# Altium schematic sheet STM32.SchDoc
size A3; SheetNumber: 2; SheetTotal: 2
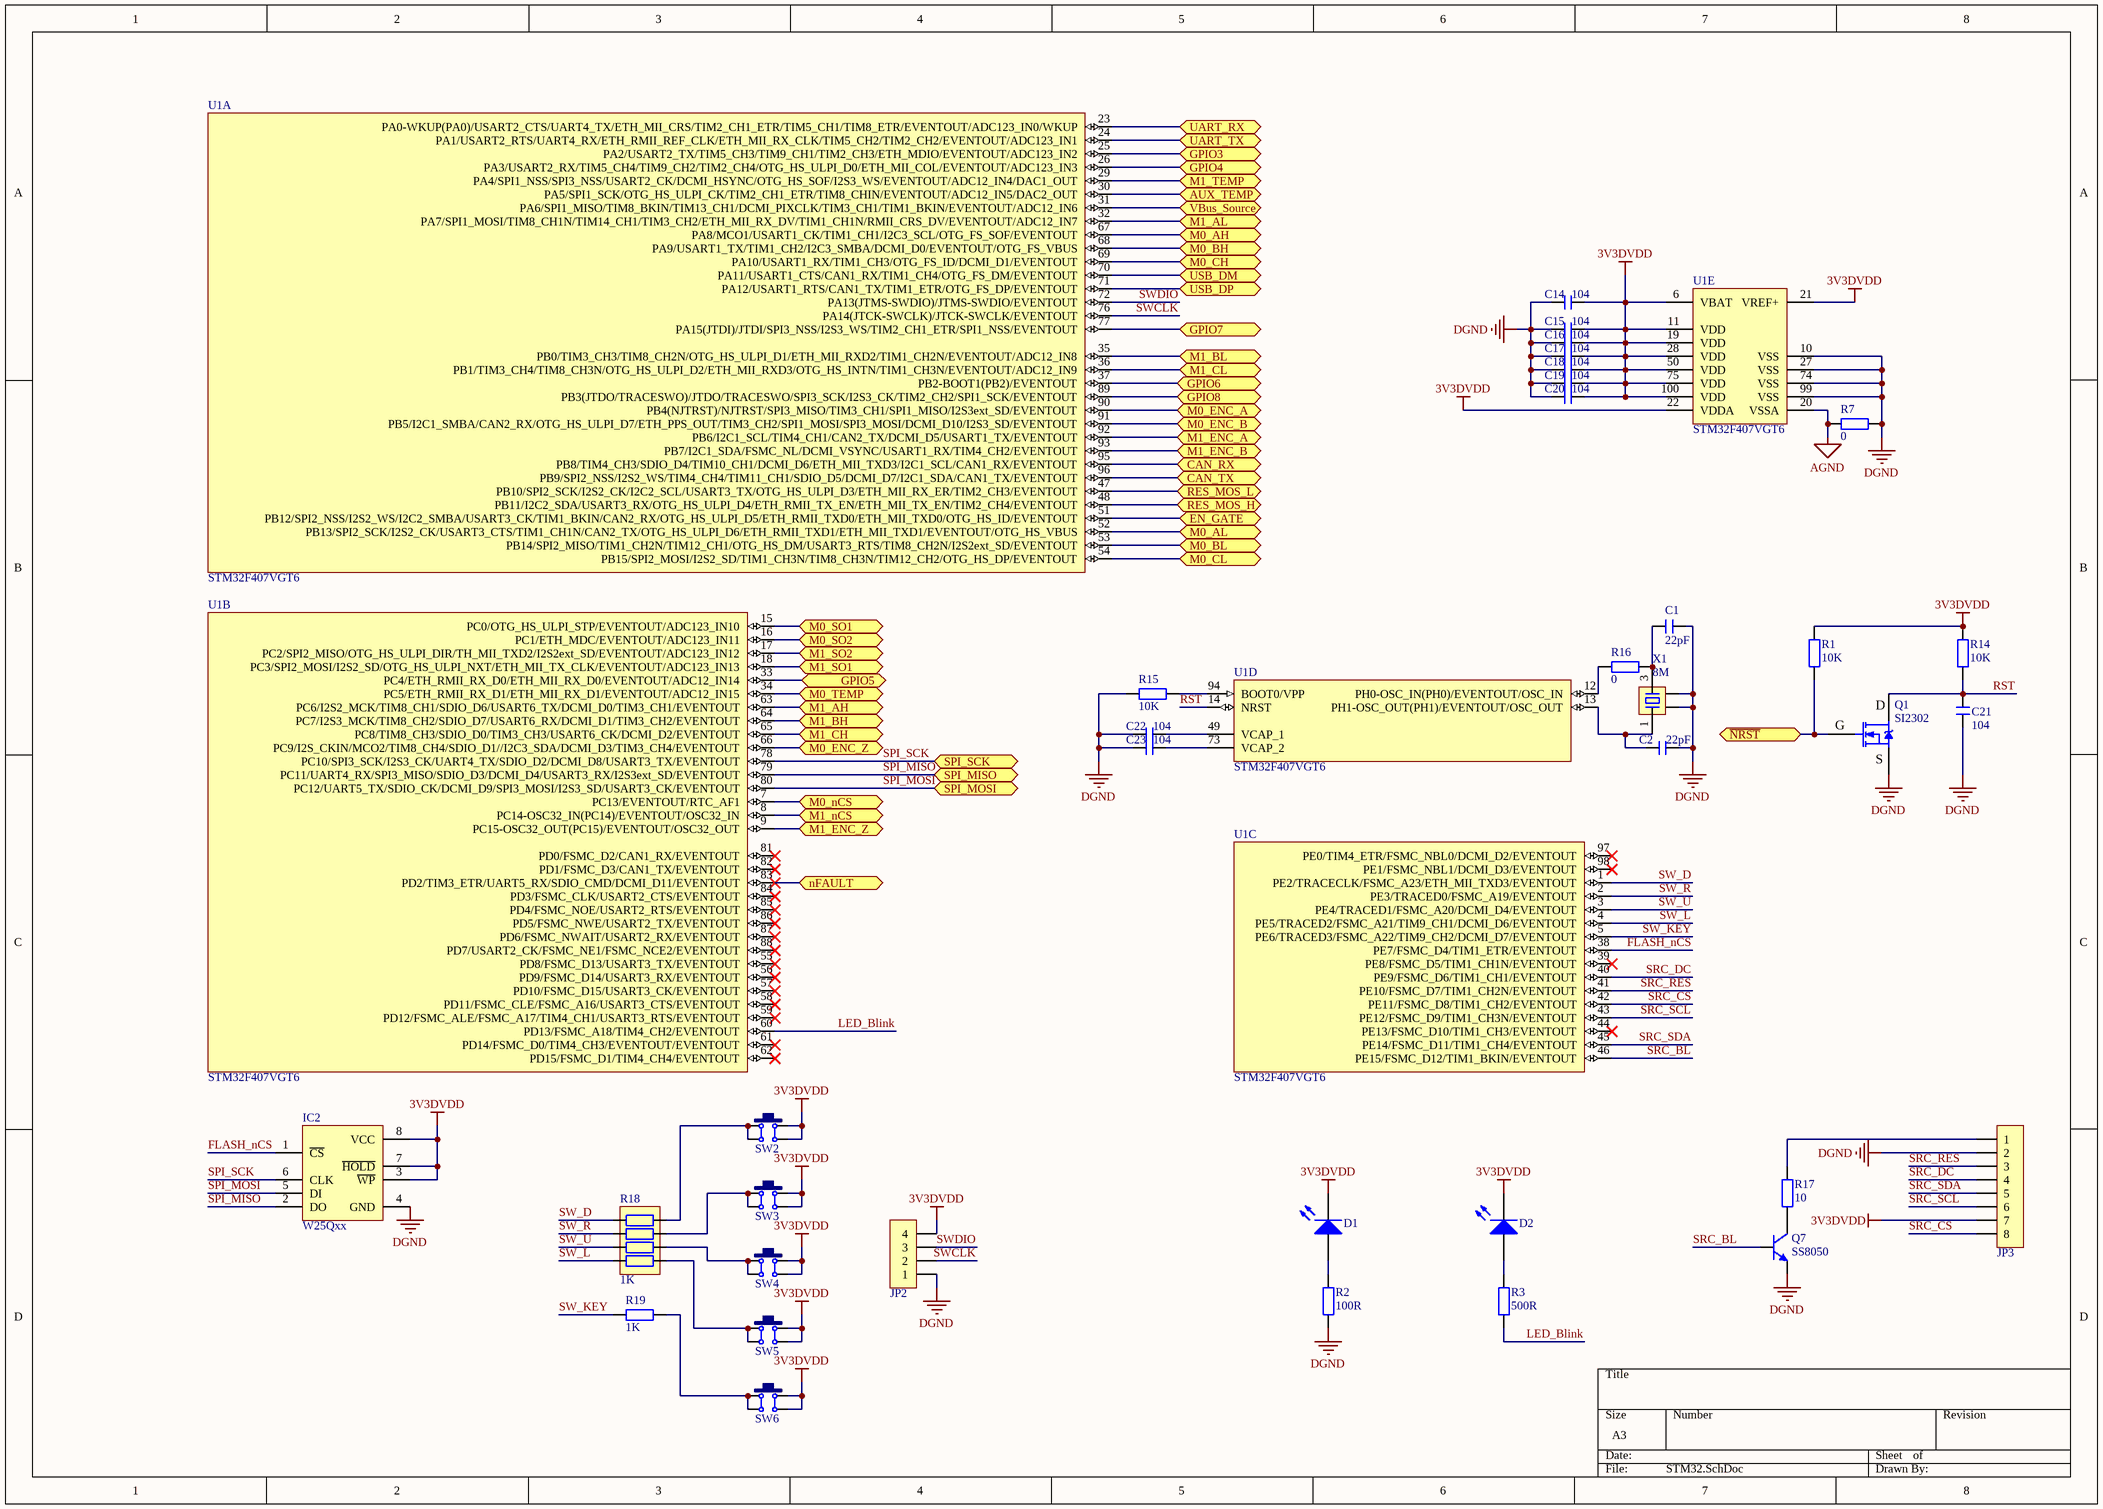
[diagram p0: STM32.SchDoc]

## Parts
C1  22pF  [C 0603_L]
C2  22pF  [C 0603_L]
C14  104  [C 0603_L]
C15  104  [C 0603_L]
C16  104  [C 0603_L]
C17  104  [C 0603_L]
C18  104  [C 0603_L]
C19  104  [C 0603_L]
C20  104  [C 0603_L]
C21  104  [C 0603_L]
C22  104  [C 0603_L]
C23  104  [C 0603_L]
D1  LED  [LED 0603W]  (value not drawn)
D2  LED  [LED 0603W]  (value not drawn)
IC2  W25Qxx  [SOP8W_N]
JP2  HDR-1X4  [HDR2.54-LI-4P]  (value not drawn)
JP3  HDR-1X8  [FPC0.5 2H-WS-8P]  (value not drawn)
Q1  SI2302  [SOT23-3N]
Q7  SS8050  [SOT23-3N]
R1  10K  [R 0603_L]
R2  100R  [R 0603_L]
R3  500R  [R 0603_L]
R7  0  [R 0603_L]
R14  10K  [R 0603_L]
R15  10K  [R 0603_L]
R16  0  [R 0603_L]
R17  10  [R 0603_L]
R18  1K  [RCA-8P4R-0603]
R19  1K  [R 0603_L]
SW2  6x6x5  [TSW SMD-6*6*4.3]  (value not drawn)
SW3  6x6x5  [TSW SMD-6*6*4.3]  (value not drawn)
SW4  6x6x5  [TSW SMD-6*6*4.3]  (value not drawn)
SW5  6x6x5  [TSW SMD-6*6*4.3]  (value not drawn)
SW6  6x6x5  [TSW SMD-6*6*4.3]  (value not drawn)
U1  STM32F407VGT6  [LQFP100_V]  (parts A,B,C,D,E of 5)
X1  8M  [OSC 3225-4P]

## Ports
AUX_TEMP (bidir), CAN_RX (bidir), CAN_TX (bidir), EN_GATE (bidir), GPIO3 (bidir), GPIO4 (bidir), GPIO5 (bidir), GPIO6 (bidir), GPIO7 (bidir), GPIO8 (bidir), M0_AH (bidir), M0_AL (bidir), M0_BH (bidir), M0_BL (bidir), M0_CH (bidir), M0_CL (bidir), M0_ENC_A (bidir), M0_ENC_B (bidir), M0_ENC_Z (bidir), M0_nCS (bidir), M0_SO1 (bidir), M0_SO2 (bidir), M0_TEMP (bidir), M1_AH (bidir), M1_AL (bidir), M1_BH (bidir), M1_BL (bidir), M1_CH (bidir), M1_CL (bidir), M1_ENC_A (bidir), M1_ENC_B (bidir), M1_ENC_Z (bidir), M1_nCS (bidir), M1_SO1 (bidir), M1_SO2 (bidir), M1_TEMP (bidir), nFAULT (bidir), RES_MOS_H (bidir), RES_MOS_L (bidir), SPI_MISO (bidir), SPI_MOSI (bidir), SPI_SCK (bidir), UART_RX (bidir), UART_TX (bidir), USB_DM (bidir), USB_DP (bidir), VBus_Source (bidir), ~{NRST} (bidir)

## Nets
3V3DVDD: C14.2 C15.2 C16.2 C17.2 C18.2 C19.2 C20.2 D1.2(K) D2.2(K) IC2.3(~{WP}) IC2.7(~{HOLD}) IC2.8(VCC) JP2.4 JP3.7 R1.2 R14.2 SW2.2 SW2.3 SW3.2 SW3.3 SW4.2 SW4.3 SW5.2 SW5.3 SW6.2 SW6.3 U1.6(VBAT) U1.11(VDD) U1.19(VDD) U1.21(VREF+) U1.22(VDDA) U1.28(VDD) U1.50(VDD) U1.75(VDD) U1.100(VDD)
AGND: R7.2 U1.20(VSSA)
DGND: C1.1 C2.2 C14.1 C15.1 C16.1 C17.1 C18.1 C19.1 C20.1 C21.1 C22.1 C23.1 IC2.4(GND) JP2.1 JP3.2 Q1.2(S) Q7.2(E) R2.1 R7.1 R15.1 U1.10(VSS) U1.27(VSS) U1.74(VSS) U1.99(VSS) X1.2 X1.4
AUX_TEMP: U1.30(PA5/SPI1_SCK/OTG_HS_ULPI_CK/TIM2_CH1_ETR/TIM8_CHIN/EVENTOUT/ADC12_IN5/DAC2_OUT) ; port AUX_TEMP
CAN_RX: U1.95(PB8/TIM4_CH3/SDIO_D4/TIM10_CH1/DCMI_D6/ETH_MII_TXD3/I2C1_SCL/CAN1_RX/EVENTOUT) ; port CAN_RX
CAN_TX: U1.96(PB9/SPI2_NSS/I2S2_WS/TIM4_CH4/TIM11_CH1/SDIO_D5/DCMI_D7/I2C1_SDA/CAN1_TX/EVENTOUT) ; port CAN_TX
EN_GATE: U1.51(PB12/SPI2_NSS/I2S2_WS/I2C2_SMBA/USART3_CK/TIM1_BKIN/CAN2_RX/OTG_HS_ULPI_D5/ETH_RMII_TXD0/ETH_MII_TXD0/OTG_HS_ID/EVENTOUT) ; port EN_GATE
FLASH_nCS: IC2.1(~{CS}) U1.38(PE7/FSMC_D4/TIM1_ETR/EVENTOUT)
GPIO3: U1.25(PA2/USART2_TX/TIM5_CH3/TIM9_CH1/TIM2_CH3/ETH_MDIO/EVENTOUT/ADC123_IN2) ; port GPIO3
GPIO4: U1.26(PA3/USART2_RX/TIM5_CH4/TIM9_CH2/TIM2_CH4/OTG_HS_ULPI_D0/ETH_MII_COL/EVENTOUT/ADC123_IN3) ; port GPIO4
GPIO5: U1.33(PC4/ETH_RMII_RX_D0/ETH_MII_RX_D0/EVENTOUT/ADC12_IN14) ; port GPIO5
GPIO6: U1.37(PB2-BOOT1(PB2)/EVENTOUT) ; port GPIO6
GPIO7: U1.77(PA15(JTDI)/JTDI/SPI3_NSS/I2S3_WS/TIM2_CH1_ETR/SPI1_NSS/EVENTOUT) ; port GPIO7
GPIO8: U1.89(PB3(JTDO/TRACESWO)/JTDO/TRACESWO/SPI3_SCK/I2S3_CK/TIM2_CH2/SPI1_SCK/EVENTOUT) ; port GPIO8
LED_Blink: R3.1 U1.60(PD13/FSMC_A18/TIM4_CH2/EVENTOUT)
M0_AH: U1.67(PA8/MCO1/USART1_CK/TIM1_CH1/I2C3_SCL/OTG_FS_SOF/EVENTOUT) ; port M0_AH
M0_AL: U1.52(PB13/SPI2_SCK/I2S2_CK/USART3_CTS/TIM1_CH1N/CAN2_TX/OTG_HS_ULPI_D6/ETH_RMII_TXD1/ETH_MII_TXD1/EVENTOUT/OTG_HS_VBUS) ; port M0_AL
M0_BH: U1.68(PA9/USART1_TX/TIM1_CH2/I2C3_SMBA/DCMI_D0/EVENTOUT/OTG_FS_VBUS) ; port M0_BH
M0_BL: U1.53(PB14/SPI2_MISO/TIM1_CH2N/TIM12_CH1/OTG_HS_DM/USART3_RTS/TIM8_CH2N/I2S2ext_SD/EVENTOUT) ; port M0_BL
M0_CH: U1.69(PA10/USART1_RX/TIM1_CH3/OTG_FS_ID/DCMI_D1/EVENTOUT) ; port M0_CH
M0_CL: U1.54(PB15/SPI2_MOSI/I2S2_SD/TIM1_CH3N/TIM8_CH3N/TIM12_CH2/OTG_HS_DP/EVENTOUT) ; port M0_CL
M0_ENC_A: U1.90(PB4(NJTRST)/NJTRST/SPI3_MISO/TIM3_CH1/SPI1_MISO/I2S3ext_SD/EVENTOUT) ; port M0_ENC_A
M0_ENC_B: U1.91(PB5/I2C1_SMBA/CAN2_RX/OTG_HS_ULPI_D7/ETH_PPS_OUT/TIM3_CH2/SPI1_MOSI/SPI3_MOSI/DCMI_D10/I2S3_SD/EVENTOUT) ; port M0_ENC_B
M0_ENC_Z: U1.66(PC9/I2S_CKIN/MCO2/TIM8_CH4/SDIO_D1//I2C3_SDA/DCMI_D3/TIM3_CH4/EVENTOUT) ; port M0_ENC_Z
M0_nCS: U1.7(PC13/EVENTOUT/RTC_AF1) ; port M0_nCS
M0_SO1: U1.15(PC0/OTG_HS_ULPI_STP/EVENTOUT/ADC123_IN10) ; port M0_SO1
M0_SO2: U1.16(PC1/ETH_MDC/EVENTOUT/ADC123_IN11) ; port M0_SO2
M0_TEMP: U1.34(PC5/ETH_RMII_RX_D1/ETH_MII_RX_D1/EVENTOUT/ADC12_IN15) ; port M0_TEMP
M1_AH: U1.63(PC6/I2S2_MCK/TIM8_CH1/SDIO_D6/USART6_TX/DCMI_D0/TIM3_CH1/EVENTOUT) ; port M1_AH
M1_AL: U1.32(PA7/SPI1_MOSI/TIM8_CH1N/TIM14_CH1/TIM3_CH2/ETH_MII_RX_DV/TIM1_CH1N/RMII_CRS_DV/EVENTOUT/ADC12_IN7) ; port M1_AL
M1_BH: U1.64(PC7/I2S3_MCK/TIM8_CH2/SDIO_D7/USART6_RX/DCMI_D1/TIM3_CH2/EVENTOUT) ; port M1_BH
M1_BL: U1.35(PB0/TIM3_CH3/TIM8_CH2N/OTG_HS_ULPI_D1/ETH_MII_RXD2/TIM1_CH2N/EVENTOUT/ADC12_IN8) ; port M1_BL
M1_CH: U1.65(PC8/TIM8_CH3/SDIO_D0/TIM3_CH3/USART6_CK/DCMI_D2/EVENTOUT) ; port M1_CH
M1_CL: U1.36(PB1/TIM3_CH4/TIM8_CH3N/OTG_HS_ULPI_D2/ETH_MII_RXD3/OTG_HS_INTN/TIM1_CH3N/EVENTOUT/ADC12_IN9) ; port M1_CL
M1_ENC_A: U1.92(PB6/I2C1_SCL/TIM4_CH1/CAN2_TX/DCMI_D5/USART1_TX/EVENTOUT) ; port M1_ENC_A
M1_ENC_B: U1.93(PB7/I2C1_SDA/FSMC_NL/DCMI_VSYNC/USART1_RX/TIM4_CH2/EVENTOUT) ; port M1_ENC_B
M1_ENC_Z: U1.9(PC15-OSC32_OUT(PC15)/EVENTOUT/OSC32_OUT) ; port M1_ENC_Z
M1_nCS: U1.8(PC14-OSC32_IN(PC14)/EVENTOUT/OSC32_IN) ; port M1_nCS
M1_SO1: U1.18(PC3/SPI2_MOSI/I2S2_SD/OTG_HS_ULPI_NXT/ETH_MII_TX_CLK/EVENTOUT/ADC123_IN13) ; port M1_SO1
M1_SO2: U1.17(PC2/SPI2_MISO/OTG_HS_ULPI_DIR/TH_MII_TXD2/I2S2ext_SD/EVENTOUT/ADC123_IN12) ; port M1_SO2
M1_TEMP: U1.29(PA4/SPI1_NSS/SPI3_NSS/USART2_CK/DCMI_HSYNC/OTG_HS_SOF/I2S3_WS/EVENTOUT/ADC12_IN4/DAC1_OUT) ; port M1_TEMP
~{NRST}: Q1.1(G) R1.1 ; port ~{NRST}
nFAULT: U1.83(PD2/TIM3_ETR/UART5_RX/SDIO_CMD/DCMI_D11/EVENTOUT) ; port nFAULT
RES_MOS_H: U1.48(PB11/I2C2_SDA/USART3_RX/OTG_HS_ULPI_D4/ETH_RMII_TX_EN/ETH_MII_TX_EN/TIM2_CH4/EVENTOUT) ; port RES_MOS_H
RES_MOS_L: U1.47(PB10/SPI2_SCK/I2S2_CK/I2C2_SCL/USART3_TX/OTG_HS_ULPI_D3/ETH_MII_RX_ER/TIM2_CH3/EVENTOUT) ; port RES_MOS_L
RST: C21.2 Q1.3(D) R14.1 U1.14(NRST)
SPI_MISO: IC2.2(DO) U1.79(PC11/UART4_RX/SPI3_MISO/SDIO_D3/DCMI_D4/USART3_RX/I2S3ext_SD/EVENTOUT) ; port SPI_MISO
SPI_MOSI: IC2.5(DI) U1.80(PC12/UART5_TX/SDIO_CK/DCMI_D9/SPI3_MOSI/I2S3_SD/USART3_CK/EVENTOUT) ; port SPI_MOSI
SPI_SCK: IC2.6(CLK) U1.78(PC10/SPI3_SCK/I2S3_CK/UART4_TX/SDIO_D2/DCMI_D8/USART3_TX/EVENTOUT) ; port SPI_SCK
SRC_BL: Q7.1(B) U1.46(PE15/FSMC_D12/TIM1_BKIN/EVENTOUT)
SRC_CS: JP3.8 U1.42(PE11/FSMC_D8/TIM1_CH2/EVENTOUT)
SRC_DC: JP3.4 U1.40(PE9/FSMC_D6/TIM1_CH1/EVENTOUT)
SRC_RES: JP3.3 U1.41(PE10/FSMC_D7/TIM1_CH2N/EVENTOUT)
SRC_SCL: JP3.6 U1.43(PE12/FSMC_D9/TIM1_CH3N/EVENTOUT)
SRC_SDA: JP3.5 U1.45(PE14/FSMC_D11/TIM1_CH4/EVENTOUT)
SW_D: R18.8 U1.1(PE2/TRACECLK/FSMC_A23/ETH_MII_TXD3/EVENTOUT)
SW_KEY: R19.2 U1.5(PE6/TRACED3/FSMC_A22/TIM9_CH2/DCMI_D7/EVENTOUT)
SW_L: R18.5 U1.4(PE5/TRACED2/FSMC_A21/TIM9_CH1/DCMI_D6/EVENTOUT)
SW_R: R18.7 U1.2(PE3/TRACED0/FSMC_A19/EVENTOUT)
SW_U: R18.6 U1.3(PE4/TRACED1/FSMC_A20/DCMI_D4/EVENTOUT)
SWCLK: JP2.2 U1.76(PA14(JTCK-SWCLK)/JTCK-SWCLK/EVENTOUT)
SWDIO: JP2.3 U1.72(PA13(JTMS-SWDIO)/JTMS-SWDIO/EVENTOUT)
UART_RX: U1.23(PA0-WKUP(PA0)/USART2_CTS/UART4_TX/ETH_MII_CRS/TIM2_CH1_ETR/TIM5_CH1/TIM8_ETR/EVENTOUT/ADC123_IN0/WKUP) ; port UART_RX
UART_TX: U1.24(PA1/USART2_RTS/UART4_RX/ETH_RMII_REF_CLK/ETH_MII_RX_CLK/TIM5_CH2/TIM2_CH2/EVENTOUT/ADC123_IN1) ; port UART_TX
USB_DM: U1.70(PA11/USART1_CTS/CAN1_RX/TIM1_CH4/OTG_FS_DM/EVENTOUT) ; port USB_DM
USB_DP: U1.71(PA12/USART1_RTS/CAN1_TX/TIM1_ETR/OTG_FS_DP/EVENTOUT) ; port USB_DP
VBus_Source: U1.31(PA6/SPI1_MISO/TIM8_BKIN/TIM13_CH1/DCMI_PIXCLK/TIM3_CH1/TIM1_BKIN/EVENTOUT/ADC12_IN6) ; port VBus_Source
NetC1_2: C1.2 R16.1 X1.3
NetC2_1: C2.1 U1.13(PH1-OSC_OUT(PH1)/EVENTOUT/OSC_OUT) X1.1
NetC22_2: C22.2 U1.49(VCAP_1)
NetC23_2: C23.2 U1.73(VCAP_2)
NetD1_1: D1.1(A) R2.2
NetD2_1: D2.1(A) R3.2
NetJP3_1: JP3.1 R17.2
NetQ7_3: Q7.3(C) R17.1
NetR15_2: R15.2 U1.94(BOOT0/VPP)
NetR16_2: R16.2 U1.12(PH0-OSC_IN(PH0)/EVENTOUT/OSC_IN)
NetR18_1: R18.1 SW2.1 SW2.4
NetR18_2: R18.2 SW3.1 SW3.4
NetR18_3: R18.3 SW4.1 SW4.4
NetR18_4: R18.4 SW5.1 SW5.4
NetR19_1: R19.1 SW6.1 SW6.4

Not connected (* = marked no-connect by the designer): U1 39(PE8/FSMC_D5/TIM1_CH1N/EVENTOUT)* 44(PE13/FSMC_D10/TIM1_CH3/EVENTOUT)* 55(PD8/FSMC_D13/USART3_TX/EVENTOUT)* 56(PD9/FSMC_D14/USART3_RX/EVENTOUT)* 57(PD10/FSMC_D15/USART3_CK/EVENTOUT)* 58(PD11/FSMC_CLE/FSMC_A16/USART3_CTS/EVENTOUT)* 59(PD12/FSMC_ALE/FSMC_A17/TIM4_CH1/USART3_RTS/EVENTOUT)* 61(PD14/FSMC_D0/TIM4_CH3/EVENTOUT/EVENTOUT)* 62(PD15/FSMC_D1/TIM4_CH4/EVENTOUT)* 81(PD0/FSMC_D2/CAN1_RX/EVENTOUT)* 82(PD1/FSMC_D3/CAN1_TX/EVENTOUT)* 84(PD3/FSMC_CLK/USART2_CTS/EVENTOUT)* 85(PD4/FSMC_NOE/USART2_RTS/EVENTOUT)* 86(PD5/FSMC_NWE/USART2_TX/EVENTOUT)* 87(PD6/FSMC_NWAIT/USART2_RX/EVENTOUT)* 88(PD7/USART2_CK/FSMC_NE1/FSMC_NCE2/EVENTOUT)* 97(PE0/TIM4_ETR/FSMC_NBL0/DCMI_D2/EVENTOUT)* 98(PE1/FSMC_NBL1/DCMI_D3/EVENTOUT)*

## Library data of the parts
C1 C2 C14-C23 = C: 贴片电容; BOM名称: 无极性贴片电容; 淘宝ID: 封装库来自淘宝 ID：黄晶宝石; 联系售后，技术支持: https://shop463601444.taobao.com; 唯一出售店铺网址: https://shop463601444.taobao.com
D1 D2 = LED: 发光二极管; 技术支持，联系售后: https://shop463601444.taobao.com
IC2 = W25Q: SPI Flash; BOM名称: 外置Flash; 版权归属: 封装库来自淘宝 ID：黄晶宝石; 学习资源: https://shop463601444.taobao.com
JP2 = Header 4: 4P接插件; 版权归属: 封装库来自淘宝 ID：黄晶宝石; BOM名称: 4P接插件; 学习资源: https://shop463601444.taobao.com
JP3 = Header 8: 8P接插件; 版权归属: 封装库来自淘宝 ID：黄晶宝石; BOM名称: 8P接插件; 学习资源: https://shop463601444.taobao.com
Q1 = SI2302: N沟道场效应管; 技术支持，联系售后: 封装库来自淘宝 ID：黄晶宝石; BOM名称: N沟道场效应管; 学习资源: https://shop463601444.taobao.com
Q7 = 8050-SMD: 高频放大-NPN型; 版权归属: 封装库来自淘宝 ID：黄晶宝石; 属性: 40V 1.5A 1W 100MHZ; BOM名称: 高频放大-NPN型; 联系售后: https://shop463601444.taobao.com
R1-R3 R7 R14-R17 R19 = R: 贴片电阻; 版权归属: 来自淘宝 ID：黄晶宝石; 封装库来自淘宝卖家 ID：黄晶宝石: 其他店铺购入均为盗版，不享受售后技术支持服务，请立即申请退款; BOM名称: 贴片电阻; 联系售后: https://shop463601444.taobao.com
R18 = R-8P4R: 贴片排阻; BOM名称: 贴片网络排阻; 版权归属: 封装库来自淘宝 ID：黄晶宝石; 联系售后: https://shop463601444.taobao.com
SW2-SW6 = TSW SMD-6x6: 贴片6x6轻触开关; 版权归属: 封装库来自淘宝 ID：黄晶宝石; BOM名称: 贴片6x6轻触开关; 唯一出售店铺网址: https://shop463601444.taobao.com
U1 = STM32F407VGT6: ARM Cortex-M4 32b MCU+FPU, 210DMIP, 1024 kB Flash, 192+4 kB RAM, Camera, 82 I/Os, 100-pin LQFP, -40 to +85癈, Tray; Internal RAM: 192kB; Operating Frequency (Processor Speed): 168MHz; A/D Converter: 16x12-bit; D/A Converter: 2x12-bit; 16-bit Timers (IC/OC/PWM): 12x16-bit(24/24/30); 32-bit Timer (IC/OC/PWM): 2x32-bit (8/8/8); Other Timer Functions: 2xWDG, RTC, 24-bit down counter; Serial Interface: 3xSPI/2xI2S/2xI2C/3xUSART(IrDa, ISO7816)/3xUART/2xUSB OTG FS/HS, 2xCAN/Ethernet MAC10/100, SDIO; DatasheetVersion: rev2, Jan-2012; PackageVersion: 2012; PackageReference: LQFP100; PackageDescription: 100-Pin Low Profile Quad Flat Package, 14x14 mm Body, 0.5 mm Pitch; ComponentLink1Description: Manufacturer URL; ComponentLink1URL: http://www.st.com/; ComponentLink2Description: STM32F405/7 Datasheet; ComponentLink2URL: http://www.st.com/internet/com/TECHNICAL_RESOURCES/TECHNICAL_LITERATURE/DATASHEET/DM00037051.pdf; ComponentLink3Description: STM32F4 Web Page; ComponentLink3URL: http://www.st.com/internet/mcu/subclass/1521.jsp
X1 = XTAL-4P: 4脚无源晶振; 版权归属: 封装库来自淘宝卖家 ID：黄晶宝石; BOM名称: 4脚无源晶振; 学习资源: https://shop463601444.taobao.com